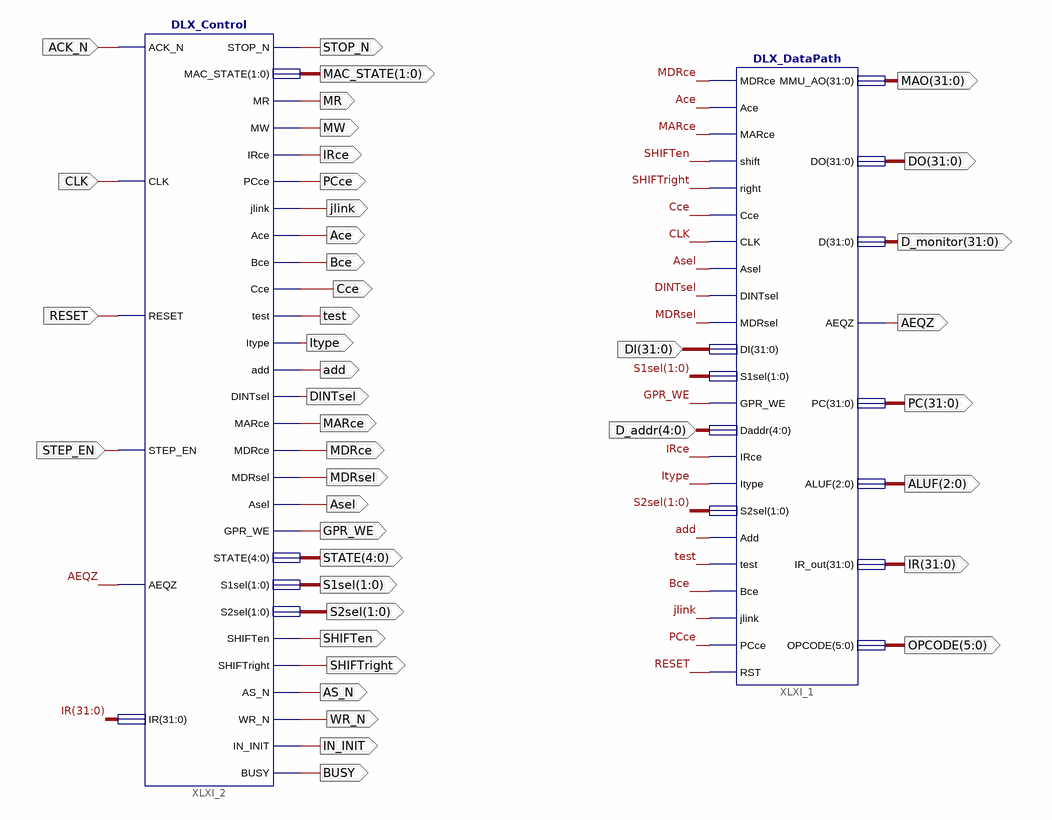
[diagram p0: schematic sheet 1]
// Xilinx ISE schematic DLX_FULL.sch (spartan6) as structural Verilog: 2 symbols, 42 ports
module DLX_FULL (
  input  ACK_N,
  input  CLK,
  input  RESET,
  input  STEP_EN,
  input  [31:0] DI,
  input  [4:0] D_addr,
  output STOP_N,
  output [1:0] MAC_STATE,
  output MR,
  output MW,
  output IRce,
  output jlink,
  output Ace,
  output Bce,
  output Cce,
  output test,
  output Itype,
  output add,
  output DINTsel,
  output MARce,
  output MDRce,
  output MDRsel,
  output Asel,
  output GPR_WE,
  output [4:0] STATE,
  output [1:0] S1sel,
  output SHIFTen,
  output SHIFTright,
  output AS_N,
  output WR_N,
  output IN_INIT,
  output [1:0] S2sel,
  output PCce,
  output [31:0] MAO,
  output [31:0] DO,
  output [31:0] D_monitor,
  output AEQZ,
  output [31:0] PC,
  output [2:0] ALUF,
  output [31:0] IR,
  output [5:0] OPCODE,
  output BUSY
);

  DLX_DataPath XLXI_1 (
    .MDRce(MDRce), .Ace(Ace), .MARce(MARce), .shift(SHIFTen), .right(SHIFTright), .Cce(Cce), .CLK(CLK),
    .Asel(Asel), .DINTsel(DINTsel), .MDRsel(MDRsel), .DI(DI), .S1sel(S1sel), .GPR_WE(GPR_WE), .Daddr(D_addr),
    .IRce(IRce), .Itype(Itype), .S2sel(S2sel), .Add(add), .test(test), .Bce(Bce), .jlink(jlink), .PCce(PCce),
    .RST(RESET), .MMU_AO(MAO), .DO(DO), .D(D_monitor), .AEQZ(AEQZ), .PC(PC), .ALUF(ALUF), .IR_out(IR),
    .OPCODE(OPCODE));
  DLX_Control XLXI_2 (
    .ACK_N(ACK_N), .CLK(CLK), .RESET(RESET), .STEP_EN(STEP_EN), .AEQZ(AEQZ), .IR(IR), .STOP_N(STOP_N),
    .MAC_STATE(MAC_STATE), .MR(MR), .MW(MW), .IRce(IRce), .PCce(PCce), .jlink(jlink), .Ace(Ace), .Bce(Bce),
    .Cce(Cce), .test(test), .Itype(Itype), .add(add), .DINTsel(DINTsel), .MARce(MARce), .MDRce(MDRce),
    .MDRsel(MDRsel), .Asel(Asel), .GPR_WE(GPR_WE), .STATE(STATE), .S1sel(S1sel), .S2sel(S2sel),
    .SHIFTen(SHIFTen), .SHIFTright(SHIFTright), .AS_N(AS_N), .WR_N(WR_N), .IN_INIT(IN_INIT), .BUSY(BUSY));
endmodule
